# EAGLE schematic thermometer_analog_meter (EAGLE 6.0)
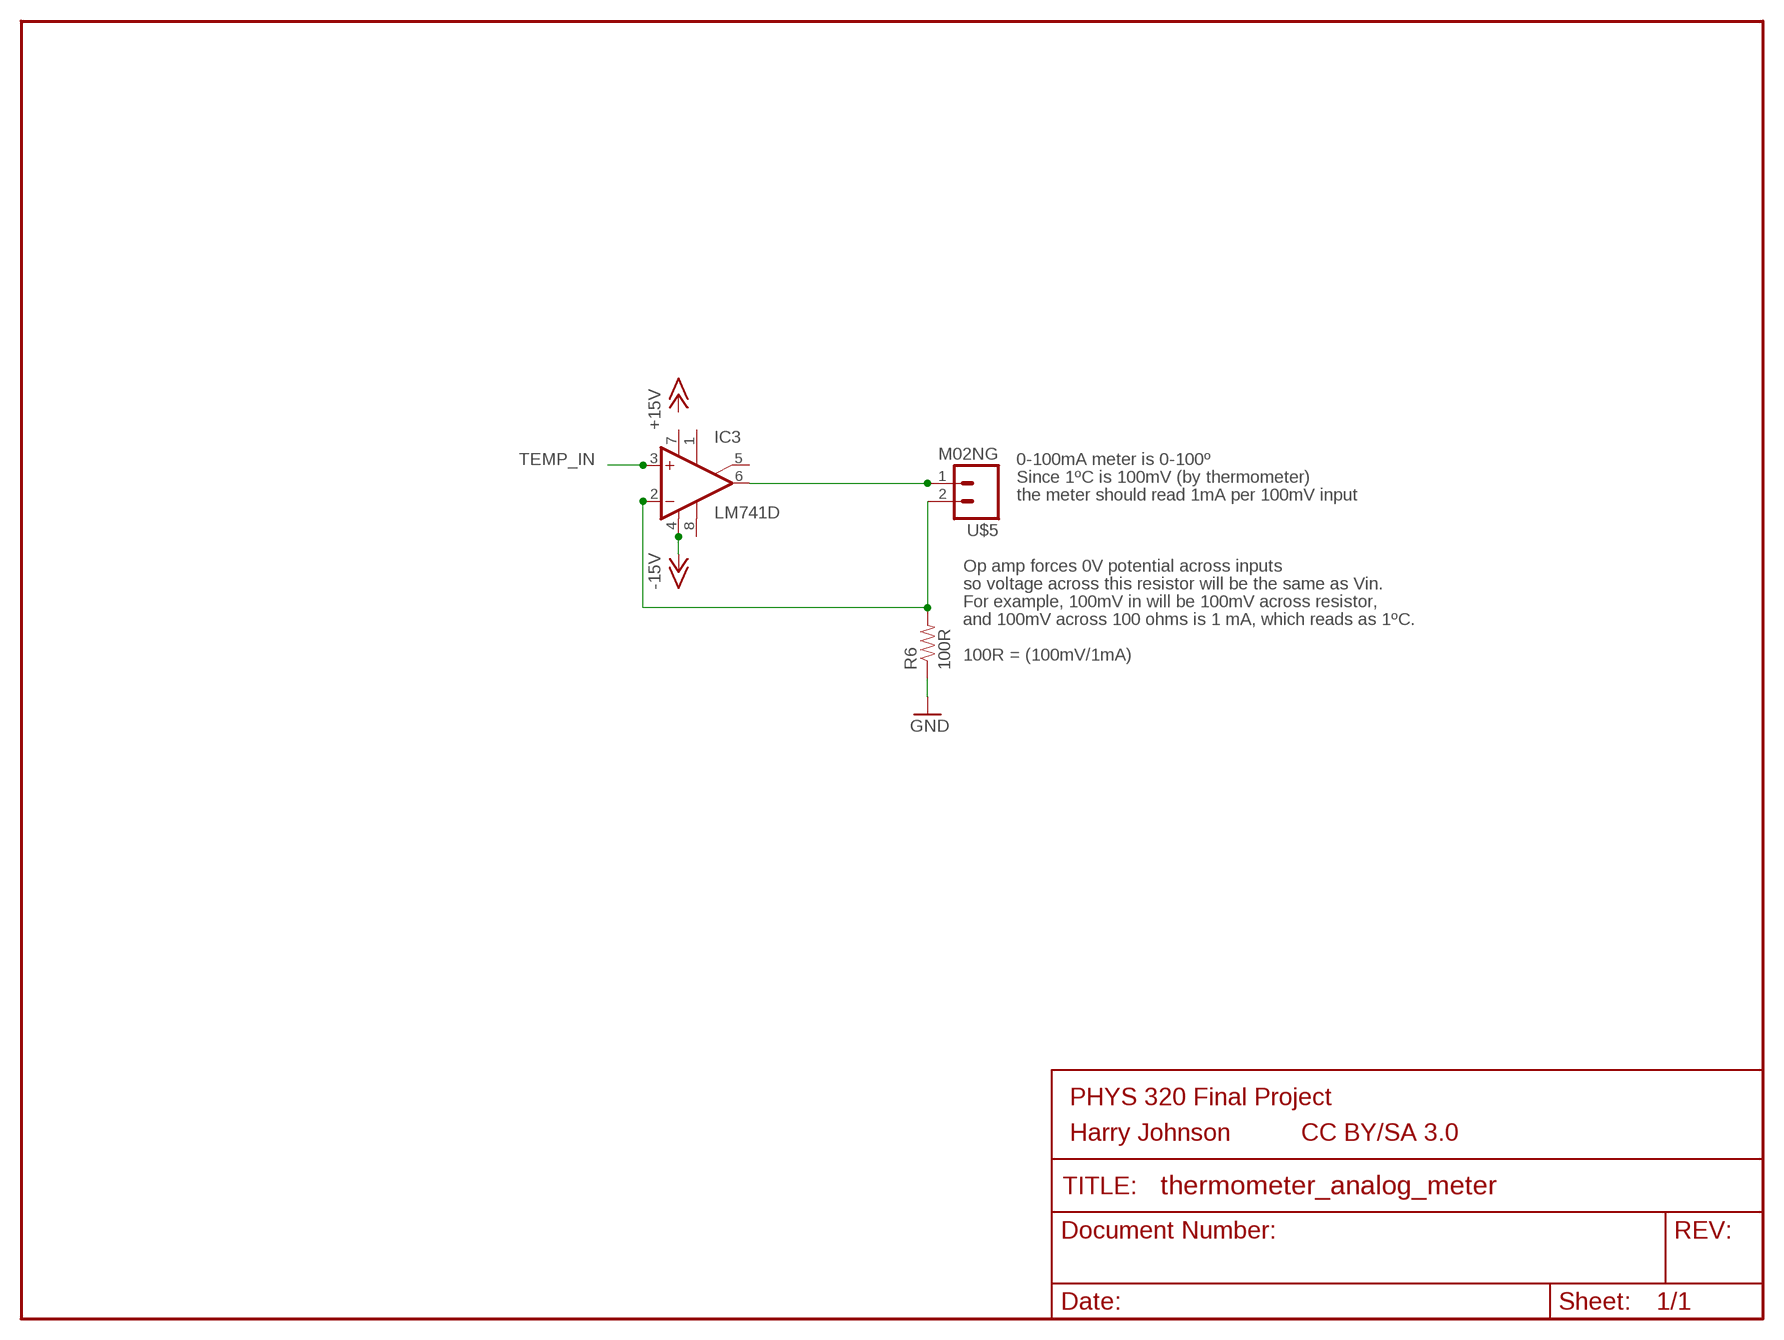
[diagram p0: schematic, sheet 1]

## Parts
IC3  LM741D  [SO08]
R6  100R  RESISTOR  [0805]
U$5  M02NG  [1X02]

## Nets
-15V: IC3.4(V-)
GND: R6.1
N$6: IC3.2(-IN) R6.2 U$5.2
N$7: IC3.6(OUT) U$5.1
TEMP_IN: IC3.3(+IN)
Unconnected: IC3.1(ON1) IC3.5(ON2) IC3.8(OPT)

## Notes on the sheet
- 0-100mA meter is 0-100º
- Since 1ºC is 100mV (by thermometer)
- the meter should read 1mA per 100mV input
- Op amp forces 0V potential across inputs
- so voltage across this resistor will be the same as Vin.
- For example, 100mV in will be 100mV across resistor,
- and 100mV across 100 ohms is 1 mA, which reads as 1ºC.
- 100R = (100mV/1mA)
- PHYS 320 Final Project
- Harry Johnson | CC BY/SA 3.0

## Power pins joined to a net without a drawn wire
V+: IC3.7(V+)

## Library data of the parts
IC3 = linear:*741: OP AMP
R6 = SparkFun:RESISTOR: Resistor Basic schematic elements and footprints for 0603, 1206, and PTH 1/10th watt (small) resistors.
U$5 = SparkFun:M02NG